# Altium schematic sheet SPI Flash.SchDoc
size A4; SheetNumber: 1; SheetTotal: 1
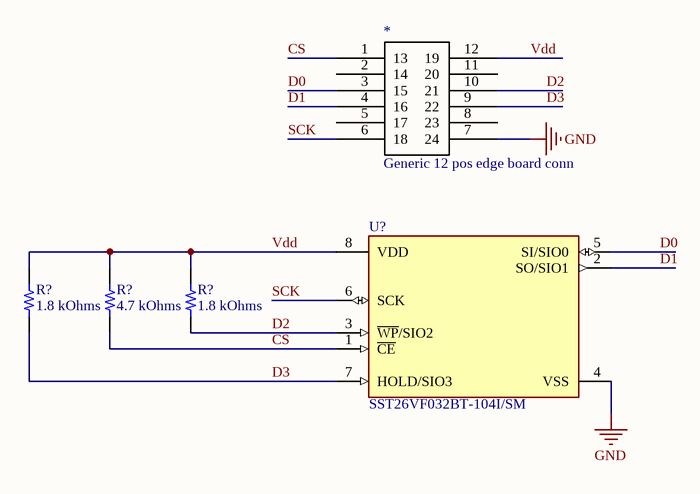
[diagram p0: SPI Flash.SchDoc]

## Parts
(Parts that share a designator on the sheet are numbered #1, #2 ... from top to bottom, then left to right.)
*  Generic 12 pos edge board conn  [12 Pos Generic]
R?#1  1.8 kOhms  [RES 0805_2012]
R?#2  4.7 kOhms  [RES 0805_2012]
R?#3  1.8 kOhms  [RES 0805_2012]
U?  SST26VF032BT-104I/SM  [FP-C04-056-MFG]

## Nets
GND: *.7(24) U?.4(VSS)
CS: *.1(13) R?#2.1 U?.1(~{CE})
D0: *.3(15) U?.5(SI/SIO0)
D1: *.4(16) U?.2(SO/SIO1)
D2: *.10(21) R?#3.1 U?.3(~{WP}/SIO2)
D3: *.9(22) R?#1.1 U?.7(HOLD/SIO3)
SCK: *.6(18) U?.6(SCK)
Vdd: *.12(19) R?#1.2 R?#2.2 R?#3.2 U?.8(VDD)

Not connected (* = marked no-connect by the designer): * 2(14) 5(17) 8(23) 11(20)

## Library data of the parts
R?#1 R?#3 = RNCF0805DTE1K80: RES 1.8K OHM 0.5% 1/8W 0805; Manufacturer: Stackpole Electronics Inc; Power (Watts): 0.125W, 1/8W; Temperature Coefficient: ±25ppm/°C; Part Number: RNCF0805DTE1K80; Value: 1.8 kOhms; ComponentLink1Description: Datasheet; ComponentLink1URL: https://www.seielect.com/catalog/sei-rncf.pdf; ComponentLink2Description: DigiKey Link; ComponentLink2URL: http://digikey.com/product-detail/en/stackpole-electronics-inc/RNCF0805DTE1K80/RNCF0805DTE1K80CT-ND/9915335; Composition: Thin Film; Device Package: 0805 (2012 Metric); Features: Automotive AEC-Q200; Height - Seated (Max): 0.026" (0.65mm); LastUpdated: 2020-09-02 1:14:51 AM; Lifecycle Status: Active; Minimum Order: 1; Number of Terminations: 2; Operating Temperature: -55°C ~ 155°C; Package / Case: 0805 (2012 Metric); Packaging: TapeAndReel; PartId: 42812; Part Status: Active; Price: 0.02; Ratings: AEC-Q200; Resistance: 1.8 kOhms; Series: RNCF; Size / Dimension: 0.079" L x 0.049" W (2.00mm x 1.25mm); Supplier 1: DigiKey; Supplier Part Number 1: RNCF0805DTE1K80CT-ND; Supplier Device Package: 0805; Tolerance: ±0.5%
R?#2 = RNCF0805DTE4K70: RES 4.7K OHM 0.5% 1/8W 0805; Manufacturer: Stackpole Electronics Inc; Power (Watts): 0.125W, 1/8W; Temperature Coefficient: ±25ppm/°C; Part Number: RNCF0805DTE4K70; Value: 4.7 kOhms; ComponentLink1Description: Datasheet; ComponentLink1URL: https://www.seielect.com/catalog/sei-rncf.pdf; ComponentLink2Description: DigiKey Link; ComponentLink2URL: http://digikey.com/product-detail/en/stackpole-electronics-inc/RNCF0805DTE4K70/RNCF0805DTE4K70CT-ND/9915430; Composition: Thin Film; Device Package: 0805 (2012 Metric); Features: Automotive AEC-Q200; Height - Seated (Max): 0.026" (0.65mm); LastUpdated: 2020-09-02 1:14:50 AM; Lifecycle Status: Active; Minimum Order: 1; Number of Terminations: 2; Operating Temperature: -55°C ~ 155°C; Package / Case: 0805 (2012 Metric); Packaging: TapeAndReel; PartId: 42899; Part Status: Active; Price: 0.02; Ratings: AEC-Q200; Resistance: 4.7 kOhms; Series: RNCF; Size / Dimension: 0.079" L x 0.049" W (2.00mm x 1.25mm); Supplier 1: DigiKey; Supplier Part Number 1: RNCF0805DTE4K70CT-ND; Supplier Device Package: 0805; Tolerance: ±0.5%
U? = CMP-06315-000001-1: IC FLASH 32M SPI 104MHZ 8SOIJ; Manufacturer: Microchip; Nominal Supply Current: 8000-15uA; Max Supply Voltage: 3.6V; Memory Size: 32Mbits; Standoff Height: 0.05mm; Min Supply Voltage: 2.7V; Lead Free: Yes; RoHS: TRUE; Interface: SPI; Temperature Range High: +85°C; Temperature Range Low: -40°C; Octopart: https://octopart.com/sst26vf032bt-104i%2Fsm-microchip-30578441; Device Class L3: Flash; Manufacturer Part Number: SST26VF032BT-104I/SM; Mouser Description: Flash Memory 32Mb 2.7V-3.6V SQI Flash Memory; Category: IC; Height: 2.03mm; Memory Type: FLASH; Digikey Description: IC FLASH 32M SPI 104MHZ 8SOIJ; Automotive: No; Package: C04-056; Device Class L2: Memory; Frequency: 104MHz; ComponentLink2Description: Datasheet; ComponentLink2URL: http://ww1.microchip.com/downloads/en/DeviceDoc/20005218H.pdf; Device Class L1: Integrated Circuits (ICs); Temperature: -40°C to +85°C